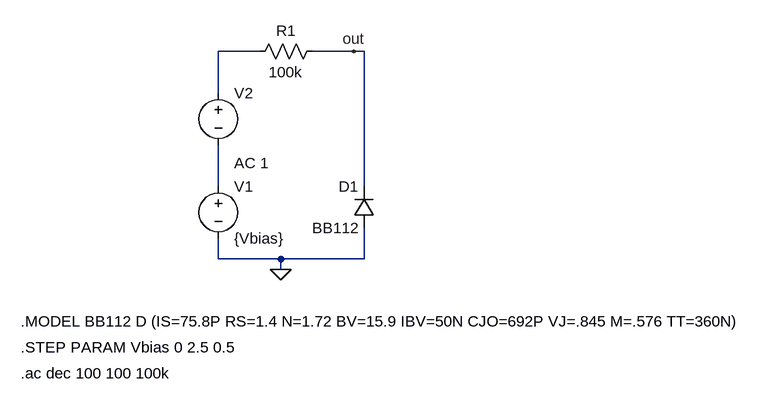
[diagram p0: schematic b112_StudentVersion.asc]
b112_StudentVersion.asc, the LTspice schematic file:
Version 4
SHEET 1 1204 680
WIRE 144 -64 80 -64
WIRE 288 -64 224 -64
WIRE 304 -64 288 -64
WIRE 80 0 80 -64
WIRE 80 144 80 80
WIRE 304 144 304 -64
WIRE 80 256 80 224
WIRE 176 256 80 256
WIRE 304 256 304 208
WIRE 304 256 176 256
WIRE 176 272 176 256
FLAG 176 272 0
FLAG 288 -64 out
SYMBOL voltage 80 128 R0
WINDOW 123 0 0 Left 2
WINDOW 39 0 0 Left 2
SYMATTR InstName V1
SYMATTR Value {Vbias}
SYMBOL res 240 -80 R90
WINDOW 0 0 56 VBottom 2
WINDOW 3 32 56 VTop 2
SYMATTR InstName R1
SYMATTR Value 100k
SYMBOL diode 320 208 R180
WINDOW 0 24 64 Left 2
WINDOW 3 24 0 Left 2
SYMATTR InstName D1
SYMATTR Value BB112
SYMBOL voltage 80 -16 R0
WINDOW 123 24 124 Left 2
WINDOW 39 0 0 Left 2
SYMATTR InstName V2
SYMATTR Value ""
SYMATTR Value2 AC 1
TEXT -224 352 Left 2 !.MODEL BB112 D (IS=75.8P RS=1.4 N=1.72 BV=15.9 IBV=50N CJO=692P VJ=.845 M=.576 TT=360N)
TEXT -224 392 Left 2 !.STEP PARAM Vbias 0 2.5 0.5
TEXT -224 432 Left 2 !.ac dec 100 100 100k

The netlist it stands for:
* b112_StudentVersion.asc
V1 N002 0 {Vbias}
R1 out N001 100k
D1 0 out BB112
V2 N001 N002 AC 1
.model D D
.lib standard.dio
.MODEL BB112 D (IS=75.8P RS=1.4 N=1.72 BV=15.9 IBV=50N CJO=692P VJ=.845 M=.576 TT=360N)
.STEP PARAM Vbias 0 2.5 0.5
.ac dec 100 100 100k
.backanno
.end

* Results of the author's LTspice run, read from the files saved beside the schematic
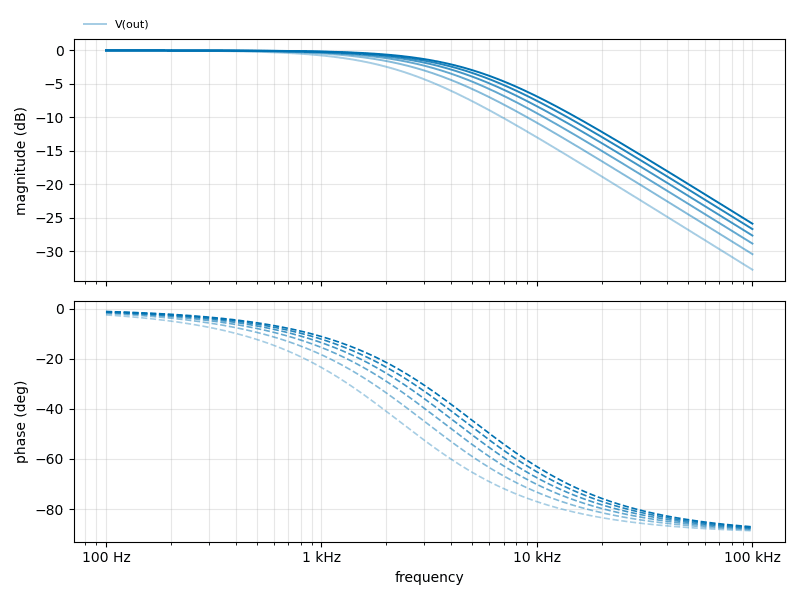
[diagram p1: AC Analysis of b112_StudentVersion.asc, plotted from the saved traces]
* AC Analysis, 6 runs:
*   V(out) [run 1]: -0.01 dB at 100 Hz, -32.77 dB at 100 kHz, peak -0.01 dB at 100 Hz, 3 dB below the peak at 2.305 kHz
*   V(out) [run 2]: -0.00 dB at 100 Hz, -30.44 dB at 100 kHz, peak -0.00 dB at 100 Hz, 3 dB below the peak at 3.009 kHz
*   V(out) [run 3]: -0.00 dB at 100 Hz, -28.86 dB at 100 kHz, peak -0.00 dB at 100 Hz, 3 dB below the peak at 3.609 kHz
*   V(out) [run 4]: -0.00 dB at 100 Hz, -27.67 dB at 100 kHz, peak -0.00 dB at 100 Hz, 3 dB below the peak at 4.143 kHz
*   V(out) [run 5]: -0.00 dB at 100 Hz, -26.70 dB at 100 kHz, peak -0.00 dB at 100 Hz, 3 dB below the peak at 4.63 kHz
*   V(out) [run 6]: -0.00 dB at 100 Hz, -25.89 dB at 100 kHz, peak -0.00 dB at 100 Hz, 3 dB below the peak at 5.082 kHz